# EAGLE schematic Shematic (EAGLE 9.6.2)
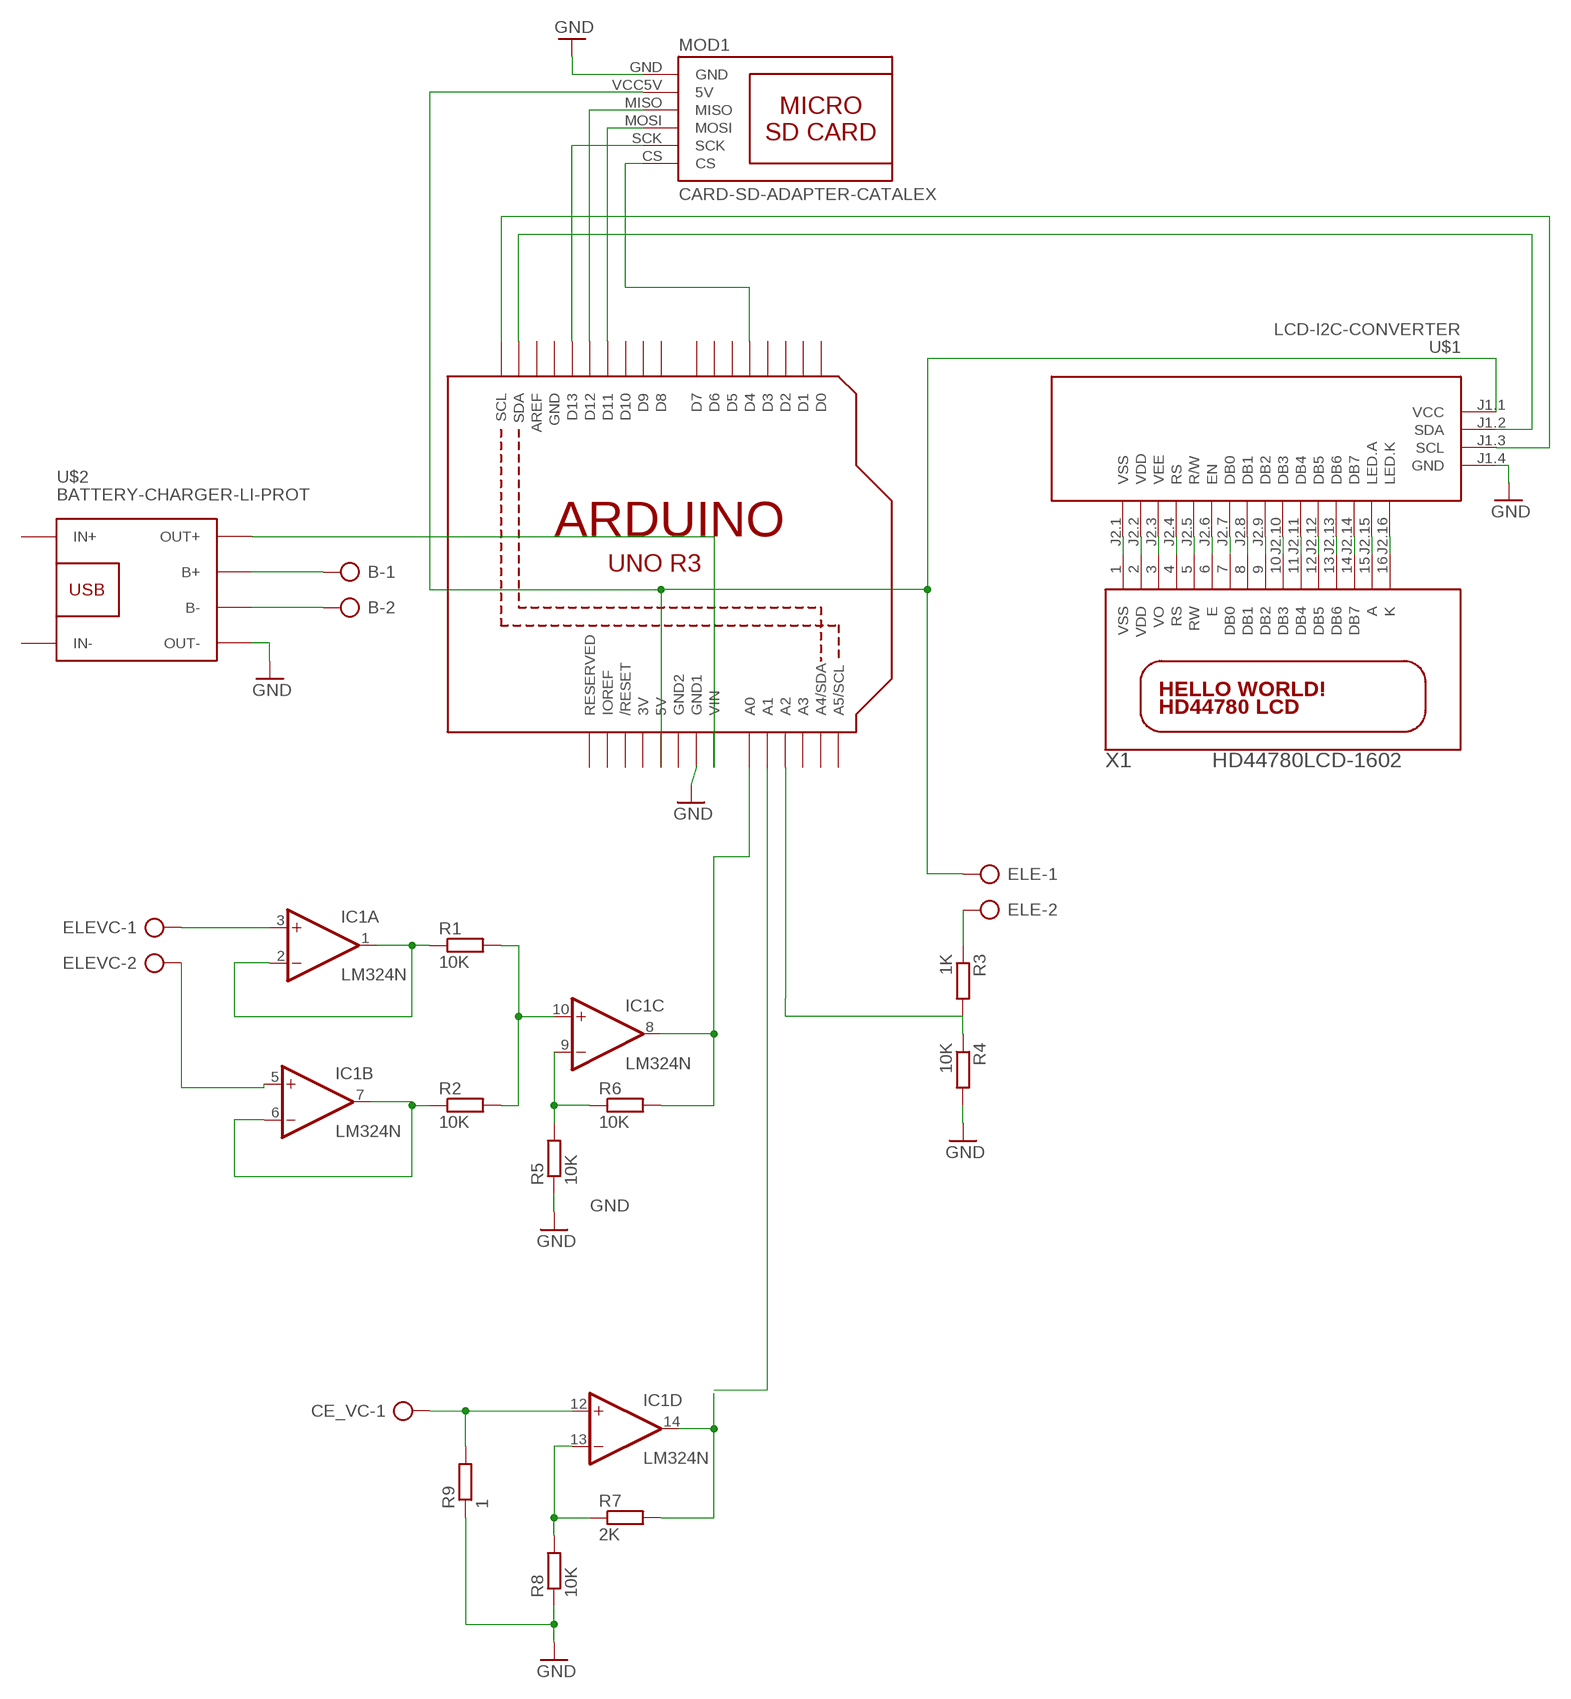
[diagram p0: schematic, sheet 1]

## Parts
B  AK500/2-H  [AK500/2-H]
CE_VC  AK500/2-H  [AK500/2-H]
ELE  AK500/2-H  [AK500/2-H]
ELEVC  AK500/2-H  [AK500/2-H]
IC1  LM324N  [DIL14]
MOD1  CARD-SD-ADAPTER-CATALEX  [CARD-SD-ADAPTER-CATALEX]
R1  10K  R-EU_0204/7  [0204/7]
R2  10K  R-EU_0204/7  [0204/7]
R3  1K  R-EU_0204/7  [0204/7]
R4  10K  R-EU_0204/7  [0204/7]
R5  10K  R-EU_0204/7  [0204/7]
R6  10K  R-EU_0204/7  [0204/7]
R7  2K  R-EU_0204/7  [0204/7]
R8  10K  R-EU_0204/7  [0204/7]
R9  1  R-EU_0204/7  [0204/7]
U1  ARDUINOR3-BPLACE  [ARDUINOR3-BPLACE]
U$1  LCD-I2C-CONVERTER  [LCD-I2C-CONVERTER]
U$2  BATTERY-CHARGER-LI-PROT  [BATTERY-CHARGER-LI-PROT]
X1  HD44780LCD-1602  [LCD1602]

## Nets
A1: IC1.8(C:OUT) R6.2 U1.A0
GND: MOD1.GND R4.2 R5.1 R8.1 R9.1 U1.GND1 U$1.J1.4(GND) U$2.OUT-
N$1: U$1.J2.3(VEE) X1.3(VO)
N$2: U$1.J2.4(RS) X1.4(RS)
N$3: U$1.J2.5(R/W) X1.5(RW)
N$4: U$1.J2.6(EN) X1.6(E)
N$5: U$1.J2.7(DB0) X1.7(DB0)
N$6: U$1.J2.8(DB1) X1.8(DB1)
N$7: U$1.J2.9(DB2) X1.9(DB2)
N$8: U$1.J2.10(DB3) X1.10(DB3)
N$9: U$1.J2.11(DB4) X1.11(DB4)
N$10: U$1.J2.12(DB5) X1.12(DB5)
N$11: U$1.J2.13(DB6) X1.13(DB6)
N$12: U$1.J2.14(DB7) X1.14(DB7)
N$13: U$1.J2.15(LED.A) X1.15(A)
N$14: U$1.J2.16(LED.K) X1.16(K)
N$16: U1.SDA U$1.J1.2(SDA)
N$17: IC1.1(A:OUT) IC1.2(A:-IN) R1.1
N$18: ELEVC.1 IC1.3(A:+IN)
N$19: ELE.2 R3.1
N$21: IC1.6(B:-IN) IC1.7(B:OUT) R2.1
N$22: U1.SCL U$1.J1.3(SCL)
N$23: ELEVC.2 IC1.5(B:+IN)
N$24: IC1.9(C:-IN) R5.2 R6.1
N$25: U1.VIN U$2.OUT+
N$26: IC1.10(C:+IN) R1.2 R2.2
N$27: B.1 U$2.B+
N$28: B.2 U$2.B-
N$29: MOD1.SCK U1.D13
N$30: MOD1.MISO U1.D12
N$31: MOD1.MOSI U1.D11
N$32: MOD1.CS U1.D4
N$33: IC1.13(D:-IN) R7.1 R8.2
N$34: ELE.1 MOD1.VCC5V(5V) U1.5V U$1.J1.1(VCC)
N$35: CE_VC.1 IC1.12(D:+IN) R9.2
N$36: IC1.14(D:OUT) R7.2
N$37: R3.2 R4.1 U1.A2
N$38: U1.A1
VDD: U$1.J2.2(VDD) X1.2(VDD)
VSS: U$1.J2.1(VSS) X1.1(VSS)
Unconnected: CE_VC.2 U1.A3 U1.A4(A4/SDA) U1.A5(A5/SCL) U1.AREF U1.D0 U1.D1 U1.D2 U1.D3 U1.D5 U1.D6 U1.D7 U1.D8 U1.D9 U1.D10 U1.IOREF U1.RESERVED U1.RESET(/RESET) U$2.IN+ U$2.IN-

## Power pins joined to a net without a drawn wire
3V: U1.3V
GND: U1.GND
GND2: U1.GND2
V+: IC1.4(P:V+)
V-: IC1.11(P:V-)

## Library data of the parts
B CE_VC ELE ELEVC = con-ptr500:AK500/2-H: CONNECTOR Aug. 2004 / PTR Meßtechnik: Die Bezeichnung der Serie AK505 wurde geändert. Es handelt sich hierbei um AK500 in horizontaler Ausführung.; OC_FARNELL: unknown; OC_NEWARK: unknown
IC1 = linear:LM324: OP AMP
MOD1 = SD-Card-Module_CATALEX:CARD-SD-ADAPTER-CATALEX: Micro SD Card Adapter Module with onboard 3.3V regulator
R1-R9 = resistor:R-EU_: RESISTOR, European symbol
U1 = adafruit:ARDUINOR3: This is a new object for the new Arduino R3 - with extra pins that you may want to use (such as IOref, and duplicated A4/A5
U$1 = diy-modules:LCD-I2C-CONVERTER: I2C Bus to 4-Bit Parallel LCD Interface with LED backlight driver
U$2 = diy-modules_1:BATTERY-CHARGER-LI-PROT: Lithium Battery 5V Charger with protection circuit More details available here: http://www.instructables.com/id/DIY-Lithium-ion-Battery-Charger/step4/TP4056-based-lithium-ion-battery-charger-module/ Click here to find device on ebay.com <http://www.ebay.com/sch/tp4056+charger+usb+protection>
X1 = adafruit:HD44780LCD: HD44780 LCD Standard character type LCDs, available in sizes from 8x1 to 40x4!